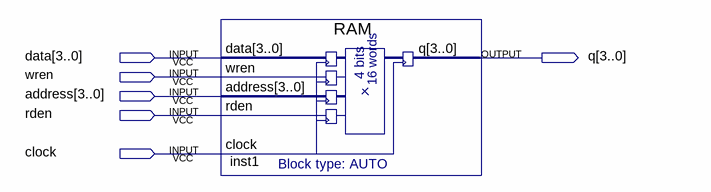
[diagram p0: schematic sheet]
// Quartus schematic 2012510017_Lab2.bdf as structural Verilog: 1 symbols, 6 pins
module \2012510017_Lab2  (
  input  [3:0] data,
  input  wren,
  input  [3:0] address,
  input  rden,
  input  clock,
  output [3:0] q
);

  RAM inst1 (.data(data), .wren(wren), .address(address), .rden(rden), .clock(clock), .q(q));
endmodule
